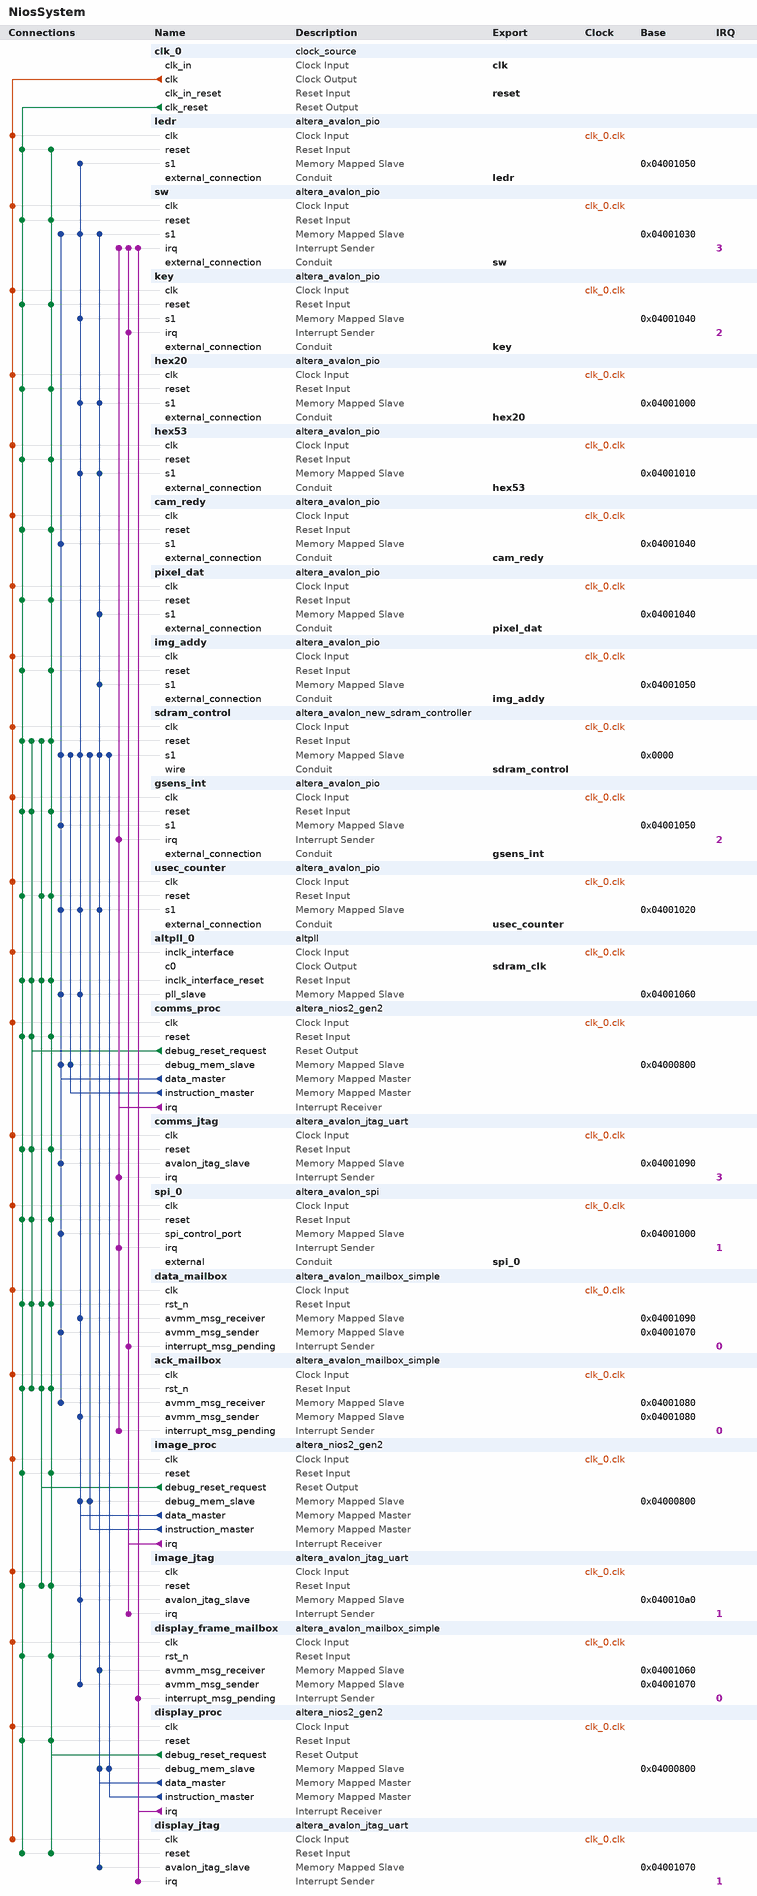
[diagram p0: system contents]
# Platform Designer (Qsys) system NiosSystem, MAX 10 10M50DAF484C7G
# Parameters at their usual value, and those the tool derives, are not listed.
package require -exact qsys 18.1
create_system NiosSystem
set_project_property DEVICE_FAMILY {MAX 10}
set_project_property DEVICE 10M50DAF484C7G

add_instance clk_0 clock_source 18.1
set_instance_parameter_value clk_0 clockFrequency 50000000

add_instance ledr altera_avalon_pio 18.1
set_instance_parameter_value ledr direction Output
set_instance_parameter_value ledr width 10

add_instance sw altera_avalon_pio 18.1
set_instance_parameter_value sw direction Input
set_instance_parameter_value sw generateIRQ true
set_instance_parameter_value sw width 10

add_instance key altera_avalon_pio 18.1
set_instance_parameter_value key direction Input
set_instance_parameter_value key generateIRQ true
set_instance_parameter_value key width 2

add_instance hex20 altera_avalon_pio 18.1
set_instance_parameter_value hex20 direction Output
set_instance_parameter_value hex20 width 24

add_instance hex53 altera_avalon_pio 18.1
set_instance_parameter_value hex53 direction Output
set_instance_parameter_value hex53 width 24

add_instance cam_redy altera_avalon_pio 18.1
set_instance_parameter_value cam_redy direction Input
set_instance_parameter_value cam_redy width 1

add_instance pixel_dat altera_avalon_pio 18.1
set_instance_parameter_value pixel_dat direction Output
set_instance_parameter_value pixel_dat width 12

add_instance img_addy altera_avalon_pio 18.1
set_instance_parameter_value img_addy direction Output
set_instance_parameter_value img_addy width 17

add_instance sdram_control altera_avalon_new_sdram_controller 18.1
set_instance_parameter_value sdram_control TAC 5.5
set_instance_parameter_value sdram_control TRCD 20.0
set_instance_parameter_value sdram_control TRP 20.0
set_instance_parameter_value sdram_control casLatency 3
set_instance_parameter_value sdram_control columnWidth 10
set_instance_parameter_value sdram_control dataWidth 16
set_instance_parameter_value sdram_control generateSimulationModel false
set_instance_parameter_value sdram_control model single_Micron_MT48LC4M32B2_7_chip
set_instance_parameter_value sdram_control numberOfBanks 4
set_instance_parameter_value sdram_control numberOfChipSelects 1
set_instance_parameter_value sdram_control powerUpDelay 100.0
set_instance_parameter_value sdram_control refreshPeriod 15.625
set_instance_parameter_value sdram_control rowWidth 13

add_instance gsens_int altera_avalon_pio 18.1
set_instance_parameter_value gsens_int captureEdge true
set_instance_parameter_value gsens_int direction Input
set_instance_parameter_value gsens_int generateIRQ true
set_instance_parameter_value gsens_int irqType EDGE
set_instance_parameter_value gsens_int width 2

add_instance usec_counter altera_avalon_pio 18.1
set_instance_parameter_value usec_counter direction Input
set_instance_parameter_value usec_counter width 32

add_instance altpll_0 altpll 18.1
set_instance_parameter_value altpll_0 CLK0_DIVIDE_BY 1
set_instance_parameter_value altpll_0 CLK0_MULTIPLY_BY 1
set_instance_parameter_value altpll_0 CLK0_PHASE_SHIFT -3000
set_instance_parameter_value altpll_0 INCLK0_INPUT_FREQUENCY 20000
set_instance_parameter_value altpll_0 PORT_ARESET PORT_UNUSED
set_instance_parameter_value altpll_0 PORT_LOCKED PORT_UNUSED
set_instance_parameter_value altpll_0 PORT_clk1 PORT_UNUSED
set_instance_parameter_value altpll_0 PORT_clk2 PORT_UNUSED
set_instance_parameter_value altpll_0 PORT_clk3 PORT_UNUSED

add_instance comms_proc altera_nios2_gen2 18.1
set_instance_parameter_value comms_proc cpuID 1
set_instance_parameter_value comms_proc dcache_size 2048
set_instance_parameter_value comms_proc exceptionSlave sdram_control.s1
set_instance_parameter_value comms_proc icache_size 4096
set_instance_parameter_value comms_proc impl Fast
set_instance_parameter_value comms_proc resetSlave sdram_control.s1

add_instance comms_jtag altera_avalon_jtag_uart 18.1
set_instance_parameter_value comms_jtag simInteractiveOptions NO_INTERACTIVE_WINDOWS

add_instance spi_0 altera_avalon_spi 18.1
set_instance_parameter_value spi_0 clockPhase 1
set_instance_parameter_value spi_0 clockPolarity 1
set_instance_parameter_value spi_0 dataWidth 8
set_instance_parameter_value spi_0 masterSPI true
set_instance_parameter_value spi_0 numberOfSlaves 2
set_instance_parameter_value spi_0 targetClockRate 5000000

add_instance data_mailbox altera_avalon_mailbox_simple 18.1
set_instance_parameter_value data_mailbox AWIDTH 2
set_instance_parameter_value data_mailbox DWIDTH 32
set_instance_parameter_value data_mailbox MSG_ARRIVAL_NOTIFY 1
set_instance_parameter_value data_mailbox MSG_SPACE_NOTIFY 0

add_instance ack_mailbox altera_avalon_mailbox_simple 18.1
set_instance_parameter_value ack_mailbox AWIDTH 2
set_instance_parameter_value ack_mailbox DWIDTH 32
set_instance_parameter_value ack_mailbox MSG_ARRIVAL_NOTIFY 1
set_instance_parameter_value ack_mailbox MSG_SPACE_NOTIFY 0

add_instance image_proc altera_nios2_gen2 18.1
set_instance_parameter_value image_proc cpuID 2
set_instance_parameter_value image_proc dcache_size 2048
set_instance_parameter_value image_proc exceptionOffset 131104
set_instance_parameter_value image_proc exceptionSlave sdram_control.s1
set_instance_parameter_value image_proc icache_size 4096
set_instance_parameter_value image_proc impl Fast
set_instance_parameter_value image_proc resetOffset 131072
set_instance_parameter_value image_proc resetSlave sdram_control.s1

add_instance image_jtag altera_avalon_jtag_uart 18.1
set_instance_parameter_value image_jtag simInteractiveOptions NO_INTERACTIVE_WINDOWS

add_instance display_frame_mailbox altera_avalon_mailbox_simple 18.1
set_instance_parameter_value display_frame_mailbox AWIDTH 2
set_instance_parameter_value display_frame_mailbox DWIDTH 32
set_instance_parameter_value display_frame_mailbox MSG_ARRIVAL_NOTIFY 1
set_instance_parameter_value display_frame_mailbox MSG_SPACE_NOTIFY 0

add_instance display_proc altera_nios2_gen2 18.1
set_instance_parameter_value display_proc cpuID 3
set_instance_parameter_value display_proc dcache_size 2048
set_instance_parameter_value display_proc exceptionOffset 262176
set_instance_parameter_value display_proc exceptionSlave sdram_control.s1
set_instance_parameter_value display_proc icache_size 4096
set_instance_parameter_value display_proc impl Fast
set_instance_parameter_value display_proc resetOffset 262144
set_instance_parameter_value display_proc resetSlave sdram_control.s1

add_instance display_jtag altera_avalon_jtag_uart 18.1
set_instance_parameter_value display_jtag simInteractiveOptions NO_INTERACTIVE_WINDOWS

# connections
add_connection clk_0.clk ack_mailbox.clk clock
add_connection clk_0.clk altpll_0.inclk_interface clock
add_connection clk_0.clk cam_redy.clk clock
add_connection clk_0.clk comms_jtag.clk clock
add_connection clk_0.clk comms_proc.clk clock
add_connection clk_0.clk data_mailbox.clk clock
add_connection clk_0.clk display_frame_mailbox.clk clock
add_connection clk_0.clk display_jtag.clk clock
add_connection clk_0.clk display_proc.clk clock
add_connection clk_0.clk gsens_int.clk clock
add_connection clk_0.clk hex20.clk clock
add_connection clk_0.clk hex53.clk clock
add_connection clk_0.clk image_jtag.clk clock
add_connection clk_0.clk image_proc.clk clock
add_connection clk_0.clk img_addy.clk clock
add_connection clk_0.clk key.clk clock
add_connection clk_0.clk ledr.clk clock
add_connection clk_0.clk pixel_dat.clk clock
add_connection clk_0.clk sdram_control.clk clock
add_connection clk_0.clk spi_0.clk clock
add_connection clk_0.clk sw.clk clock
add_connection clk_0.clk usec_counter.clk clock
add_connection clk_0.clk_reset ack_mailbox.rst_n reset
add_connection clk_0.clk_reset altpll_0.inclk_interface_reset reset
add_connection clk_0.clk_reset cam_redy.reset reset
add_connection clk_0.clk_reset comms_jtag.reset reset
add_connection clk_0.clk_reset comms_proc.reset reset
add_connection clk_0.clk_reset data_mailbox.rst_n reset
add_connection clk_0.clk_reset display_frame_mailbox.rst_n reset
add_connection clk_0.clk_reset display_jtag.reset reset
add_connection clk_0.clk_reset display_proc.reset reset
add_connection clk_0.clk_reset gsens_int.reset reset
add_connection clk_0.clk_reset hex20.reset reset
add_connection clk_0.clk_reset hex53.reset reset
add_connection clk_0.clk_reset image_jtag.reset reset
add_connection clk_0.clk_reset image_proc.reset reset
add_connection clk_0.clk_reset img_addy.reset reset
add_connection clk_0.clk_reset key.reset reset
add_connection clk_0.clk_reset ledr.reset reset
add_connection clk_0.clk_reset pixel_dat.reset reset
add_connection clk_0.clk_reset sdram_control.reset reset
add_connection clk_0.clk_reset spi_0.reset reset
add_connection clk_0.clk_reset sw.reset reset
add_connection clk_0.clk_reset usec_counter.reset reset
add_connection comms_proc.debug_reset_request ack_mailbox.rst_n reset
add_connection comms_proc.debug_reset_request altpll_0.inclk_interface_reset reset
add_connection comms_proc.debug_reset_request comms_jtag.reset reset
add_connection comms_proc.debug_reset_request comms_proc.reset reset
add_connection comms_proc.debug_reset_request data_mailbox.rst_n reset
add_connection comms_proc.debug_reset_request gsens_int.reset reset
add_connection comms_proc.debug_reset_request sdram_control.reset reset
add_connection comms_proc.debug_reset_request spi_0.reset reset
add_connection display_proc.debug_reset_request ack_mailbox.rst_n reset
add_connection display_proc.debug_reset_request altpll_0.inclk_interface_reset reset
add_connection display_proc.debug_reset_request cam_redy.reset reset
add_connection display_proc.debug_reset_request comms_jtag.reset reset
add_connection display_proc.debug_reset_request comms_proc.reset reset
add_connection display_proc.debug_reset_request data_mailbox.rst_n reset
add_connection display_proc.debug_reset_request display_frame_mailbox.rst_n reset
add_connection display_proc.debug_reset_request display_jtag.reset reset
add_connection display_proc.debug_reset_request display_proc.reset reset
add_connection display_proc.debug_reset_request gsens_int.reset reset
add_connection display_proc.debug_reset_request hex20.reset reset
add_connection display_proc.debug_reset_request hex53.reset reset
add_connection display_proc.debug_reset_request image_jtag.reset reset
add_connection display_proc.debug_reset_request image_proc.reset reset
add_connection display_proc.debug_reset_request img_addy.reset reset
add_connection display_proc.debug_reset_request key.reset reset
add_connection display_proc.debug_reset_request ledr.reset reset
add_connection display_proc.debug_reset_request pixel_dat.reset reset
add_connection display_proc.debug_reset_request sdram_control.reset reset
add_connection display_proc.debug_reset_request spi_0.reset reset
add_connection display_proc.debug_reset_request sw.reset reset
add_connection display_proc.debug_reset_request usec_counter.reset reset
add_connection image_proc.debug_reset_request ack_mailbox.rst_n reset
add_connection image_proc.debug_reset_request altpll_0.inclk_interface_reset reset
add_connection image_proc.debug_reset_request data_mailbox.rst_n reset
add_connection image_proc.debug_reset_request image_jtag.reset reset
add_connection image_proc.debug_reset_request sdram_control.reset reset
add_connection image_proc.debug_reset_request usec_counter.reset reset
add_connection comms_proc.data_master ack_mailbox.avmm_msg_receiver avalon
set_connection_parameter_value comms_proc.data_master/ack_mailbox.avmm_msg_receiver baseAddress 0x04001080
add_connection comms_proc.data_master altpll_0.pll_slave avalon
set_connection_parameter_value comms_proc.data_master/altpll_0.pll_slave baseAddress 0x04001060
add_connection comms_proc.data_master cam_redy.s1 avalon
set_connection_parameter_value comms_proc.data_master/cam_redy.s1 baseAddress 0x04001040
add_connection comms_proc.data_master comms_jtag.avalon_jtag_slave avalon
set_connection_parameter_value comms_proc.data_master/comms_jtag.avalon_jtag_slave baseAddress 0x04001090
add_connection comms_proc.data_master comms_proc.debug_mem_slave avalon
set_connection_parameter_value comms_proc.data_master/comms_proc.debug_mem_slave baseAddress 0x04000800
add_connection comms_proc.data_master data_mailbox.avmm_msg_sender avalon
set_connection_parameter_value comms_proc.data_master/data_mailbox.avmm_msg_sender baseAddress 0x04001070
add_connection comms_proc.data_master gsens_int.s1 avalon
set_connection_parameter_value comms_proc.data_master/gsens_int.s1 baseAddress 0x04001050
add_connection comms_proc.data_master sdram_control.s1 avalon
set_connection_parameter_value comms_proc.data_master/sdram_control.s1 baseAddress 0x0000
add_connection comms_proc.data_master spi_0.spi_control_port avalon
set_connection_parameter_value comms_proc.data_master/spi_0.spi_control_port baseAddress 0x04001000
add_connection comms_proc.data_master sw.s1 avalon
set_connection_parameter_value comms_proc.data_master/sw.s1 baseAddress 0x04001030
add_connection comms_proc.data_master usec_counter.s1 avalon
set_connection_parameter_value comms_proc.data_master/usec_counter.s1 baseAddress 0x04001020
add_connection comms_proc.instruction_master comms_proc.debug_mem_slave avalon
set_connection_parameter_value comms_proc.instruction_master/comms_proc.debug_mem_slave baseAddress 0x04000800
add_connection comms_proc.instruction_master sdram_control.s1 avalon
set_connection_parameter_value comms_proc.instruction_master/sdram_control.s1 baseAddress 0x0000
add_connection display_proc.data_master display_frame_mailbox.avmm_msg_receiver avalon
set_connection_parameter_value display_proc.data_master/display_frame_mailbox.avmm_msg_receiver baseAddress 0x04001060
add_connection display_proc.data_master display_jtag.avalon_jtag_slave avalon
set_connection_parameter_value display_proc.data_master/display_jtag.avalon_jtag_slave baseAddress 0x04001070
add_connection display_proc.data_master display_proc.debug_mem_slave avalon
set_connection_parameter_value display_proc.data_master/display_proc.debug_mem_slave baseAddress 0x04000800
add_connection display_proc.data_master hex20.s1 avalon
set_connection_parameter_value display_proc.data_master/hex20.s1 baseAddress 0x04001000
add_connection display_proc.data_master hex53.s1 avalon
set_connection_parameter_value display_proc.data_master/hex53.s1 baseAddress 0x04001010
add_connection display_proc.data_master img_addy.s1 avalon
set_connection_parameter_value display_proc.data_master/img_addy.s1 baseAddress 0x04001050
add_connection display_proc.data_master pixel_dat.s1 avalon
set_connection_parameter_value display_proc.data_master/pixel_dat.s1 baseAddress 0x04001040
add_connection display_proc.data_master sdram_control.s1 avalon
set_connection_parameter_value display_proc.data_master/sdram_control.s1 baseAddress 0x0000
add_connection display_proc.data_master sw.s1 avalon
set_connection_parameter_value display_proc.data_master/sw.s1 baseAddress 0x04001030
add_connection display_proc.data_master usec_counter.s1 avalon
set_connection_parameter_value display_proc.data_master/usec_counter.s1 baseAddress 0x04001020
add_connection display_proc.instruction_master display_proc.debug_mem_slave avalon
set_connection_parameter_value display_proc.instruction_master/display_proc.debug_mem_slave baseAddress 0x04000800
add_connection display_proc.instruction_master sdram_control.s1 avalon
set_connection_parameter_value display_proc.instruction_master/sdram_control.s1 baseAddress 0x0000
add_connection image_proc.data_master ack_mailbox.avmm_msg_sender avalon
set_connection_parameter_value image_proc.data_master/ack_mailbox.avmm_msg_sender baseAddress 0x04001080
add_connection image_proc.data_master altpll_0.pll_slave avalon
set_connection_parameter_value image_proc.data_master/altpll_0.pll_slave baseAddress 0x04001060
add_connection image_proc.data_master data_mailbox.avmm_msg_receiver avalon
set_connection_parameter_value image_proc.data_master/data_mailbox.avmm_msg_receiver baseAddress 0x04001090
add_connection image_proc.data_master display_frame_mailbox.avmm_msg_sender avalon
set_connection_parameter_value image_proc.data_master/display_frame_mailbox.avmm_msg_sender baseAddress 0x04001070
add_connection image_proc.data_master hex20.s1 avalon
set_connection_parameter_value image_proc.data_master/hex20.s1 baseAddress 0x04001000
add_connection image_proc.data_master hex53.s1 avalon
set_connection_parameter_value image_proc.data_master/hex53.s1 baseAddress 0x04001010
add_connection image_proc.data_master image_jtag.avalon_jtag_slave avalon
set_connection_parameter_value image_proc.data_master/image_jtag.avalon_jtag_slave baseAddress 0x040010a0
add_connection image_proc.data_master image_proc.debug_mem_slave avalon
set_connection_parameter_value image_proc.data_master/image_proc.debug_mem_slave baseAddress 0x04000800
add_connection image_proc.data_master key.s1 avalon
set_connection_parameter_value image_proc.data_master/key.s1 baseAddress 0x04001040
add_connection image_proc.data_master ledr.s1 avalon
set_connection_parameter_value image_proc.data_master/ledr.s1 baseAddress 0x04001050
add_connection image_proc.data_master sdram_control.s1 avalon
set_connection_parameter_value image_proc.data_master/sdram_control.s1 baseAddress 0x0000
add_connection image_proc.data_master sw.s1 avalon
set_connection_parameter_value image_proc.data_master/sw.s1 baseAddress 0x04001030
add_connection image_proc.data_master usec_counter.s1 avalon
set_connection_parameter_value image_proc.data_master/usec_counter.s1 baseAddress 0x04001020
add_connection image_proc.instruction_master image_proc.debug_mem_slave avalon
set_connection_parameter_value image_proc.instruction_master/image_proc.debug_mem_slave baseAddress 0x04000800
add_connection image_proc.instruction_master sdram_control.s1 avalon
set_connection_parameter_value image_proc.instruction_master/sdram_control.s1 baseAddress 0x0000
add_connection comms_proc.irq ack_mailbox.interrupt_msg_pending interrupt
set_connection_parameter_value comms_proc.irq/ack_mailbox.interrupt_msg_pending irqNumber 0
add_connection comms_proc.irq comms_jtag.irq interrupt
set_connection_parameter_value comms_proc.irq/comms_jtag.irq irqNumber 3
add_connection comms_proc.irq gsens_int.irq interrupt
set_connection_parameter_value comms_proc.irq/gsens_int.irq irqNumber 2
add_connection comms_proc.irq spi_0.irq interrupt
set_connection_parameter_value comms_proc.irq/spi_0.irq irqNumber 1
add_connection comms_proc.irq sw.irq interrupt
set_connection_parameter_value comms_proc.irq/sw.irq irqNumber 4
add_connection display_proc.irq display_frame_mailbox.interrupt_msg_pending interrupt
set_connection_parameter_value display_proc.irq/display_frame_mailbox.interrupt_msg_pending irqNumber 0
add_connection display_proc.irq display_jtag.irq interrupt
set_connection_parameter_value display_proc.irq/display_jtag.irq irqNumber 1
add_connection display_proc.irq sw.irq interrupt
set_connection_parameter_value display_proc.irq/sw.irq irqNumber 2
add_connection image_proc.irq data_mailbox.interrupt_msg_pending interrupt
set_connection_parameter_value image_proc.irq/data_mailbox.interrupt_msg_pending irqNumber 0
add_connection image_proc.irq image_jtag.irq interrupt
set_connection_parameter_value image_proc.irq/image_jtag.irq irqNumber 1
add_connection image_proc.irq key.irq interrupt
set_connection_parameter_value image_proc.irq/key.irq irqNumber 2
add_connection image_proc.irq sw.irq interrupt
set_connection_parameter_value image_proc.irq/sw.irq irqNumber 3

# exported interfaces
add_interface cam_redy conduit end
set_interface_property cam_redy EXPORT_OF cam_redy.external_connection
add_interface clk clock sink
set_interface_property clk EXPORT_OF clk_0.clk_in
add_interface gsens_int conduit end
set_interface_property gsens_int EXPORT_OF gsens_int.external_connection
add_interface hex20 conduit end
set_interface_property hex20 EXPORT_OF hex20.external_connection
add_interface hex53 conduit end
set_interface_property hex53 EXPORT_OF hex53.external_connection
add_interface img_addy conduit end
set_interface_property img_addy EXPORT_OF img_addy.external_connection
add_interface key conduit end
set_interface_property key EXPORT_OF key.external_connection
add_interface ledr conduit end
set_interface_property ledr EXPORT_OF ledr.external_connection
add_interface pixel_dat conduit end
set_interface_property pixel_dat EXPORT_OF pixel_dat.external_connection
add_interface reset reset sink
set_interface_property reset EXPORT_OF clk_0.clk_in_reset
add_interface sdram_clk clock source
set_interface_property sdram_clk EXPORT_OF altpll_0.c0
add_interface sdram_control conduit end
set_interface_property sdram_control EXPORT_OF sdram_control.wire
add_interface spi_0 conduit end
set_interface_property spi_0 EXPORT_OF spi_0.external
add_interface sw conduit end
set_interface_property sw EXPORT_OF sw.external_connection
add_interface usec_counter conduit end
set_interface_property usec_counter EXPORT_OF usec_counter.external_connection

set_interconnect_requirement {$system} qsys_mm.clockCrossingAdapter HANDSHAKE
set_interconnect_requirement {$system} qsys_mm.enableEccProtection FALSE
set_interconnect_requirement {$system} qsys_mm.insertDefaultSlave FALSE
set_interconnect_requirement {$system} qsys_mm.maxAdditionalLatency 1

save_system NiosSystem.qsys
